# Altium schematic sheet power.SchDoc
size A4; DocumentNumber: 2; SheetNumber: 2; SheetTotal: 3
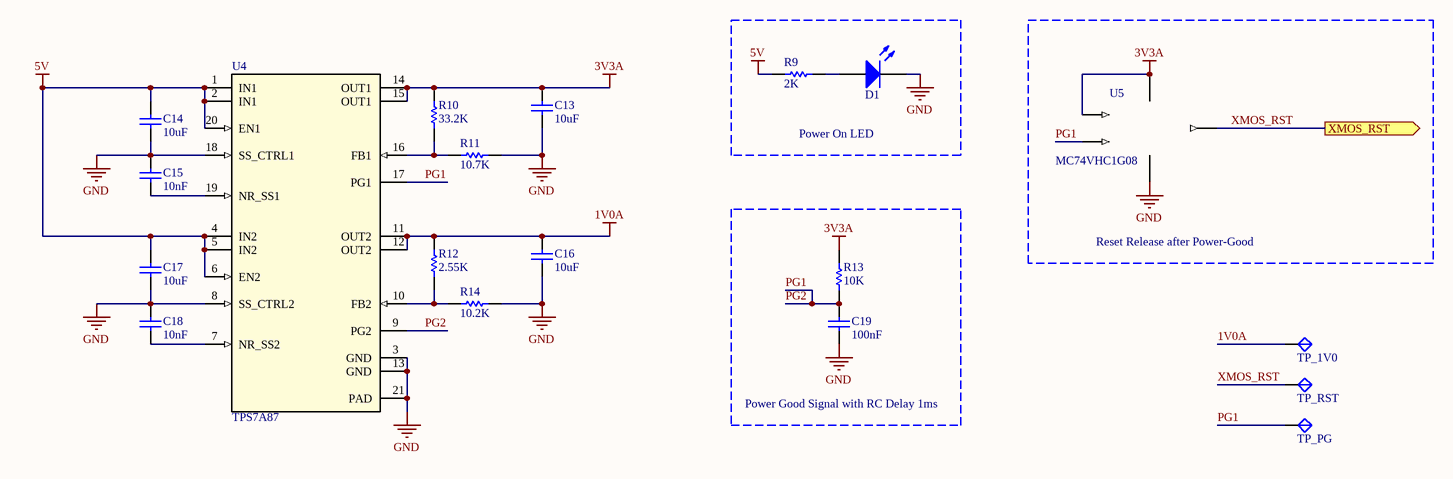
[diagram p0: power.SchDoc]

## Parts
C13  value 10uF  [CAP_0603]  (hidden comment: MLCC)
C14  value 10uF  [CAP_0603]  (hidden comment: MLCC)
C15  value 10nF  [CAP_0603]  (hidden comment: MLCC)
C16  value 10uF  [CAP_0603]  (hidden comment: MLCC)
C17  value 10uF  [CAP_0603]  (hidden comment: MLCC)
C18  value 10nF  [CAP_0603]  (hidden comment: MLCC)
C19  value 100nF  [CAP_0603]  (hidden comment: MLCC)
D1  LED  [0603_RED]  (value not drawn)
R9  value 2K  [RC0603N]  (hidden comment: RES)
R10  value 33.2K  [RC0603N]  (hidden comment: RES)
R11  value 10.7K  [RC0603N]  (hidden comment: RES)
R12  value 2.55K  [RC0603N]  (hidden comment: RES)
R13  value 10K  [RC0603N]  (hidden comment: RES)
R14  value 10.2K  [RC0603N]  (hidden comment: RES)
TP_1V0  TestPoint  [TESTPOINT(1)]  (value not drawn)
TP_PG  TestPoint  [TESTPOINT(1)]  (value not drawn)
TP_RST  TestPoint  [TESTPOINT(1)]  (value not drawn)
U4  TPS7A87  [RTJ20]
U5  MC74VHC1G08  [SC-88A]

## Blocks framed on the sheet
Power On LED: D1 R9
Reset Release after Power-Good: U5
Power Good Signal with RC Delay 1ms: C19 R13

## Ports
XMOS_RST (out)

## Nets
1V0A: C16.2 R12.2 TP_1V0.1 U4.11(OUT2) U4.12(OUT2)
3V3A: C13.2 R10.2 R13.1 U4.14(OUT1) U4.15(OUT1) U5.1(B) U5.5(VCC)
5V: C14.2 C17.2 R9.2 U4.1(IN1) U4.2(IN1) U4.4(IN2) U4.5(IN2) U4.6(EN2) U4.20(EN1)
GND: C13.1 C14.1 C15.2 C16.1 C17.1 C18.2 C19.1 D1.2(K) R11.1 R14.1 U4.3(GND) U4.8(SS_CTRL2) U4.13(GND) U4.18(SS_CTRL1) U4.21(PAD) U5.3(GND)
PG1: C19.2 R13.2 TP_PG.1 U4.9(PG2) U4.17(PG1) U5.2(A)  [also labelled PG2]
XMOS_RST: TP_RST.1 U5.4(Y) ; port XMOS_RST
NetC15_1: C15.1 U4.19(NR_SS1)
NetC18_1: C18.1 U4.7(NR_SS2)
NetD1_1: D1.1(A) R9.1
NetR10_1: R10.1 R11.2 U4.16(FB1)
NetR12_1: R12.1 R14.2 U4.10(FB2)

## Library data of the parts
C13-C19 = MLCC: Multilayer Ceramic Capacitors; VoltageRatingDC: 5V; Tolerance: 10%
D1 = LED: LED Emitters; ForwardVoltage: 2V
R9-R14 = RES: Chip Resistors; PowerRating: 0.25W
TP_1V0 TP_PG TP_RST = TestPoint: Test Point
U4 = TPS7A87: TPS7A87 Dual, 500-mA, Low-Noise (3.8 μVRMS), LDO Voltage Regulator; Manufacturer: Texas Instruments; Manufacturer_Part_Number: TPS7A8701RTJR; Built_By: Texas_Instrument_Team; Copyright: Copyright (C) 2018 Accelerated Designs. All rights reserved; RefDes: RefDes; Type: DEV; Value: Value
U5 = MC74VHC1G08: Single 2-Input AND Gate; SupplyVoltageMax: 5.5V; SupplyVoltageMin: 2V